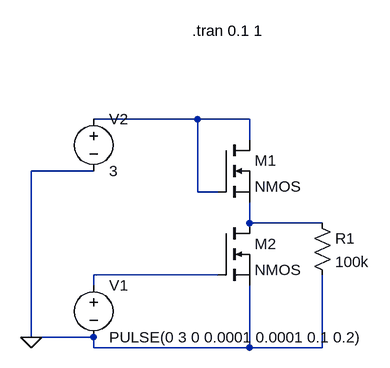
[diagram p0: schematic nmosInverter.asc]
nmosInverter.asc, the LTspice schematic file:
Version 4
SHEET 1 880 680
WIRE 448 224 288 224
WIRE 528 224 448 224
WIRE 528 256 528 224
WIRE 288 304 192 304
WIRE 448 336 448 224
WIRE 480 336 448 336
WIRE 528 384 528 352
WIRE 640 384 528 384
WIRE 480 464 288 464
WIRE 288 480 288 464
WIRE 192 560 192 304
WIRE 288 560 192 560
WIRE 288 576 288 560
WIRE 528 576 528 480
WIRE 528 576 288 576
WIRE 640 576 640 464
WIRE 640 576 528 576
FLAG 192 560 0
SYMBOL voltage 288 464 R0
SYMATTR InstName V1
SYMATTR Value PULSE(0 3 0 0.0001 0.0001 0.1 0.2)
SYMBOL voltage 288 208 R0
SYMATTR InstName V2
SYMATTR Value 3
SYMBOL nmos 480 256 R0
SYMATTR InstName M1
SYMBOL nmos 480 384 R0
SYMATTR InstName M2
SYMBOL res 624 368 R0
SYMATTR InstName R1
SYMATTR Value 100k
TEXT 440 88 Left 2 !.tran 0.1 1

The netlist it stands for:
* nmosInverter.asc
V1 N003 0 PULSE(0 3 0 0.0001 0.0001 0.1 0.2)
V2 N001 0 3
M1 N001 N001 N002 N002 NMOS
M2 N002 N003 0 0 NMOS
R1 N002 0 100k
.model NMOS NMOS
.model PMOS PMOS
.lib standard.mos
.tran 0.1 1
.backanno
.end